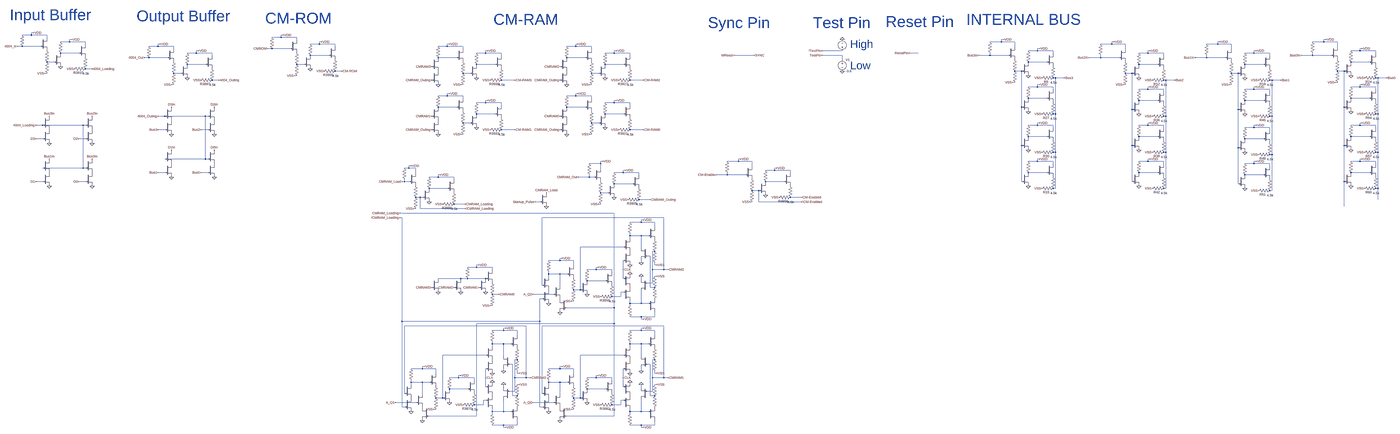
[diagram p0: schematic pins.asc, whole sheet]
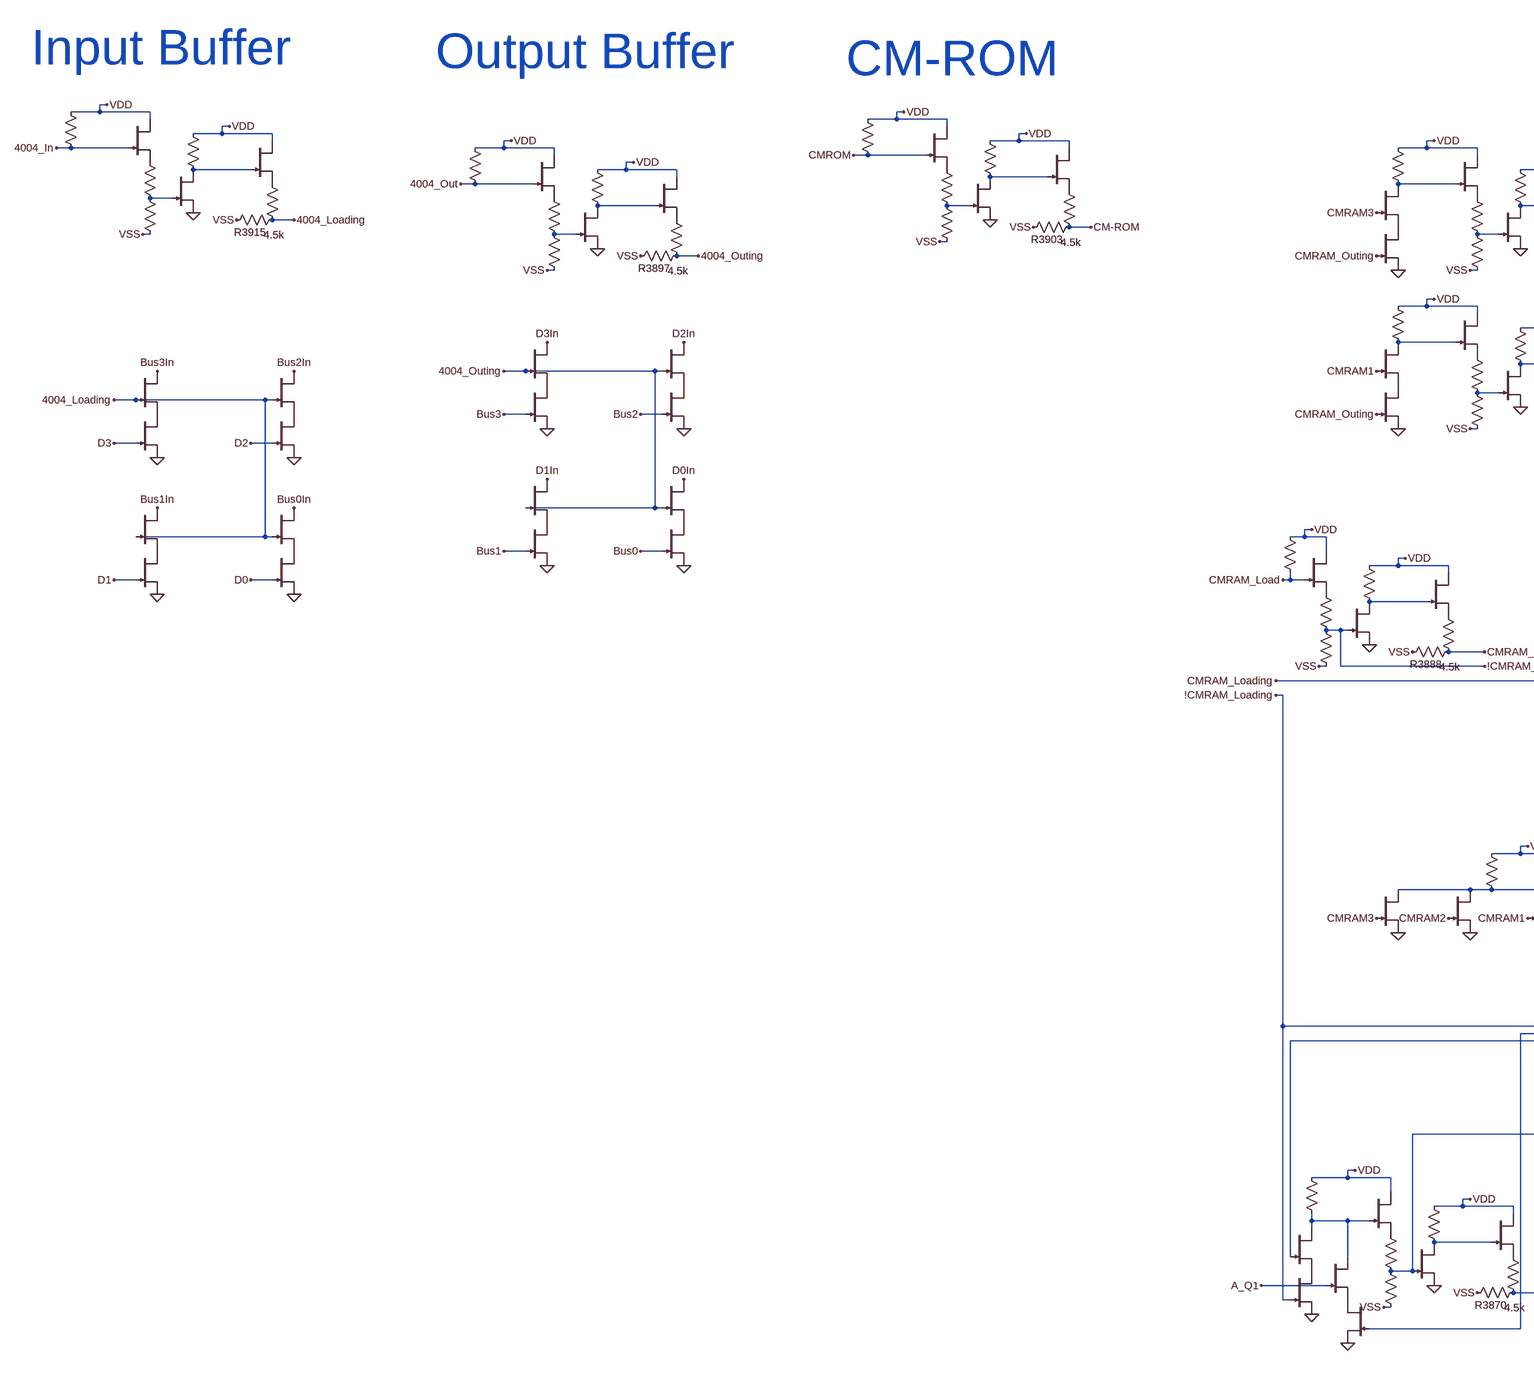
[diagram p1: schematic pins.asc, part, row 1 of 1, column 1 of 3]
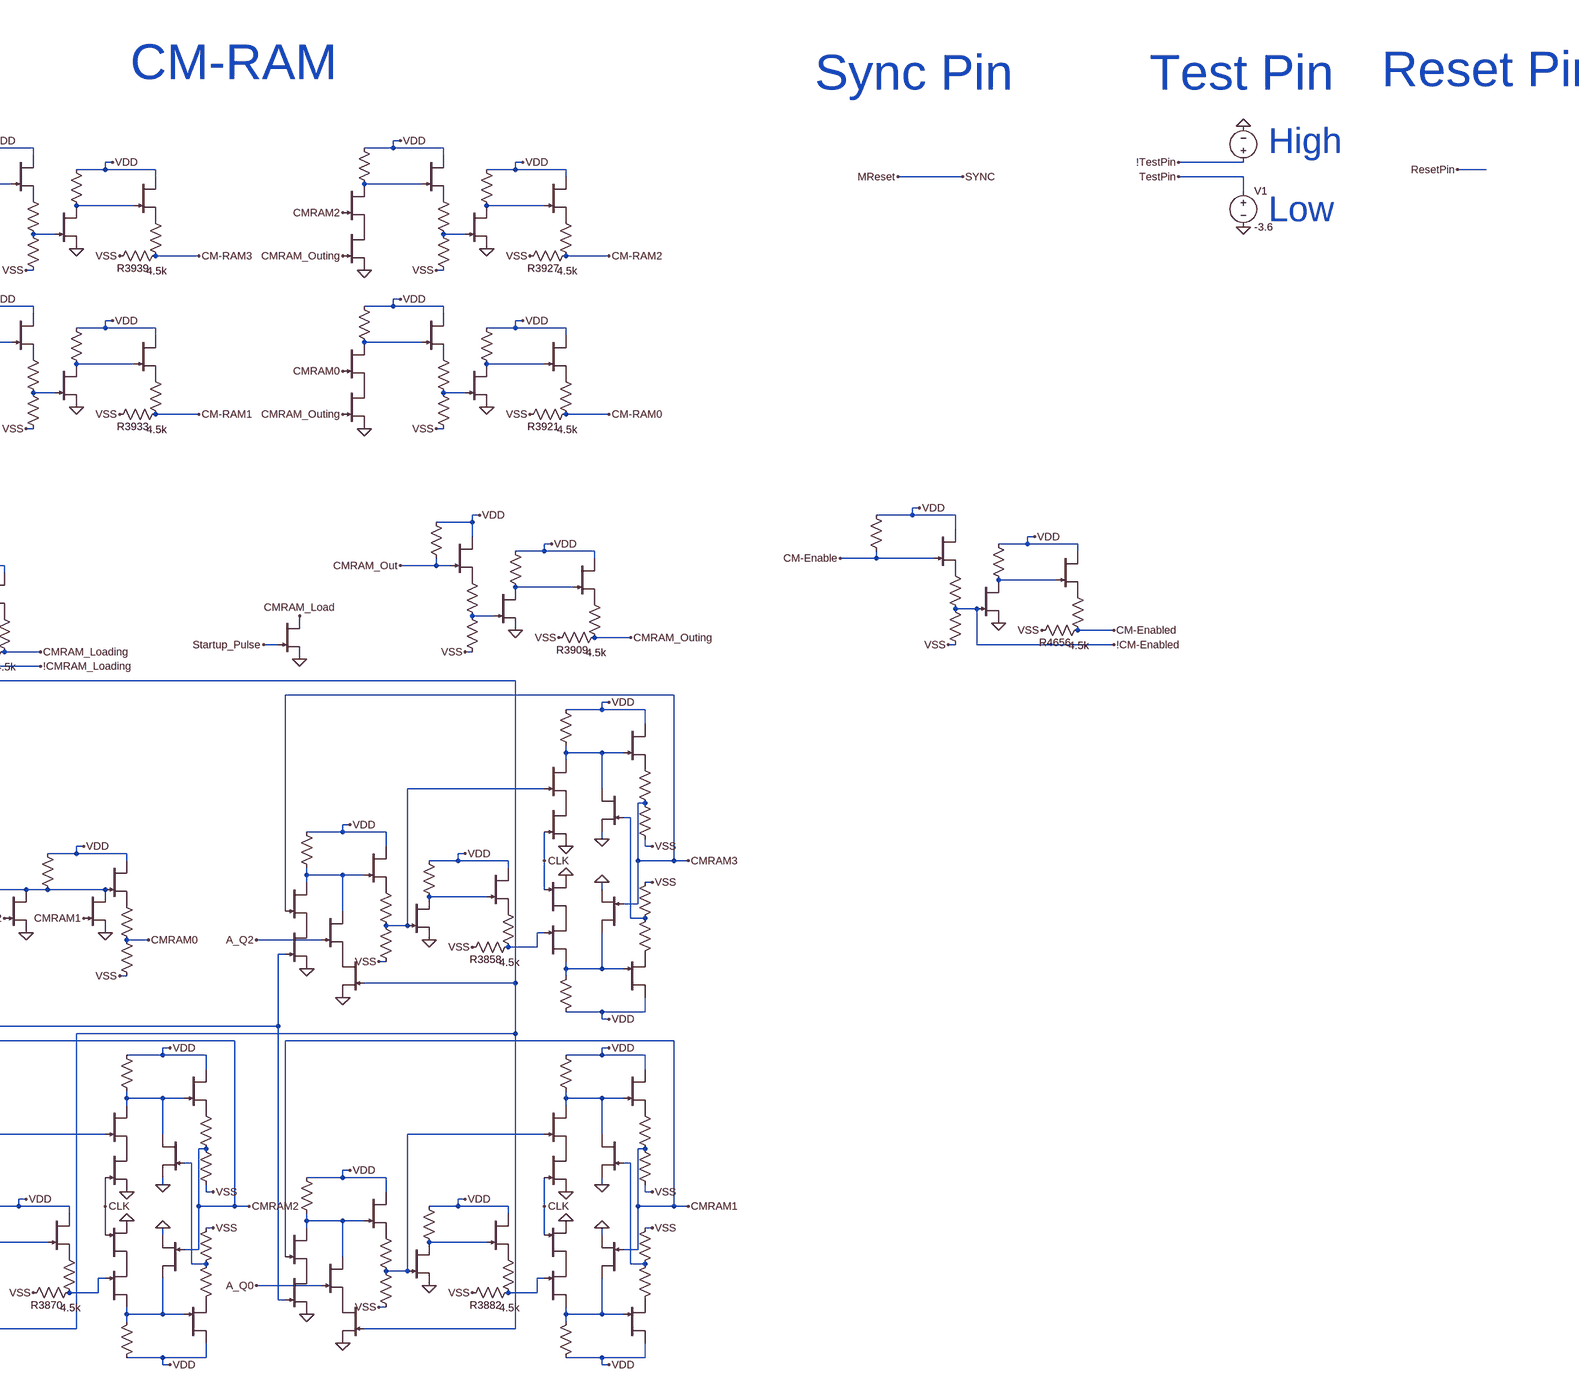
[diagram p2: schematic pins.asc, part, row 1 of 1, column 2 of 3]
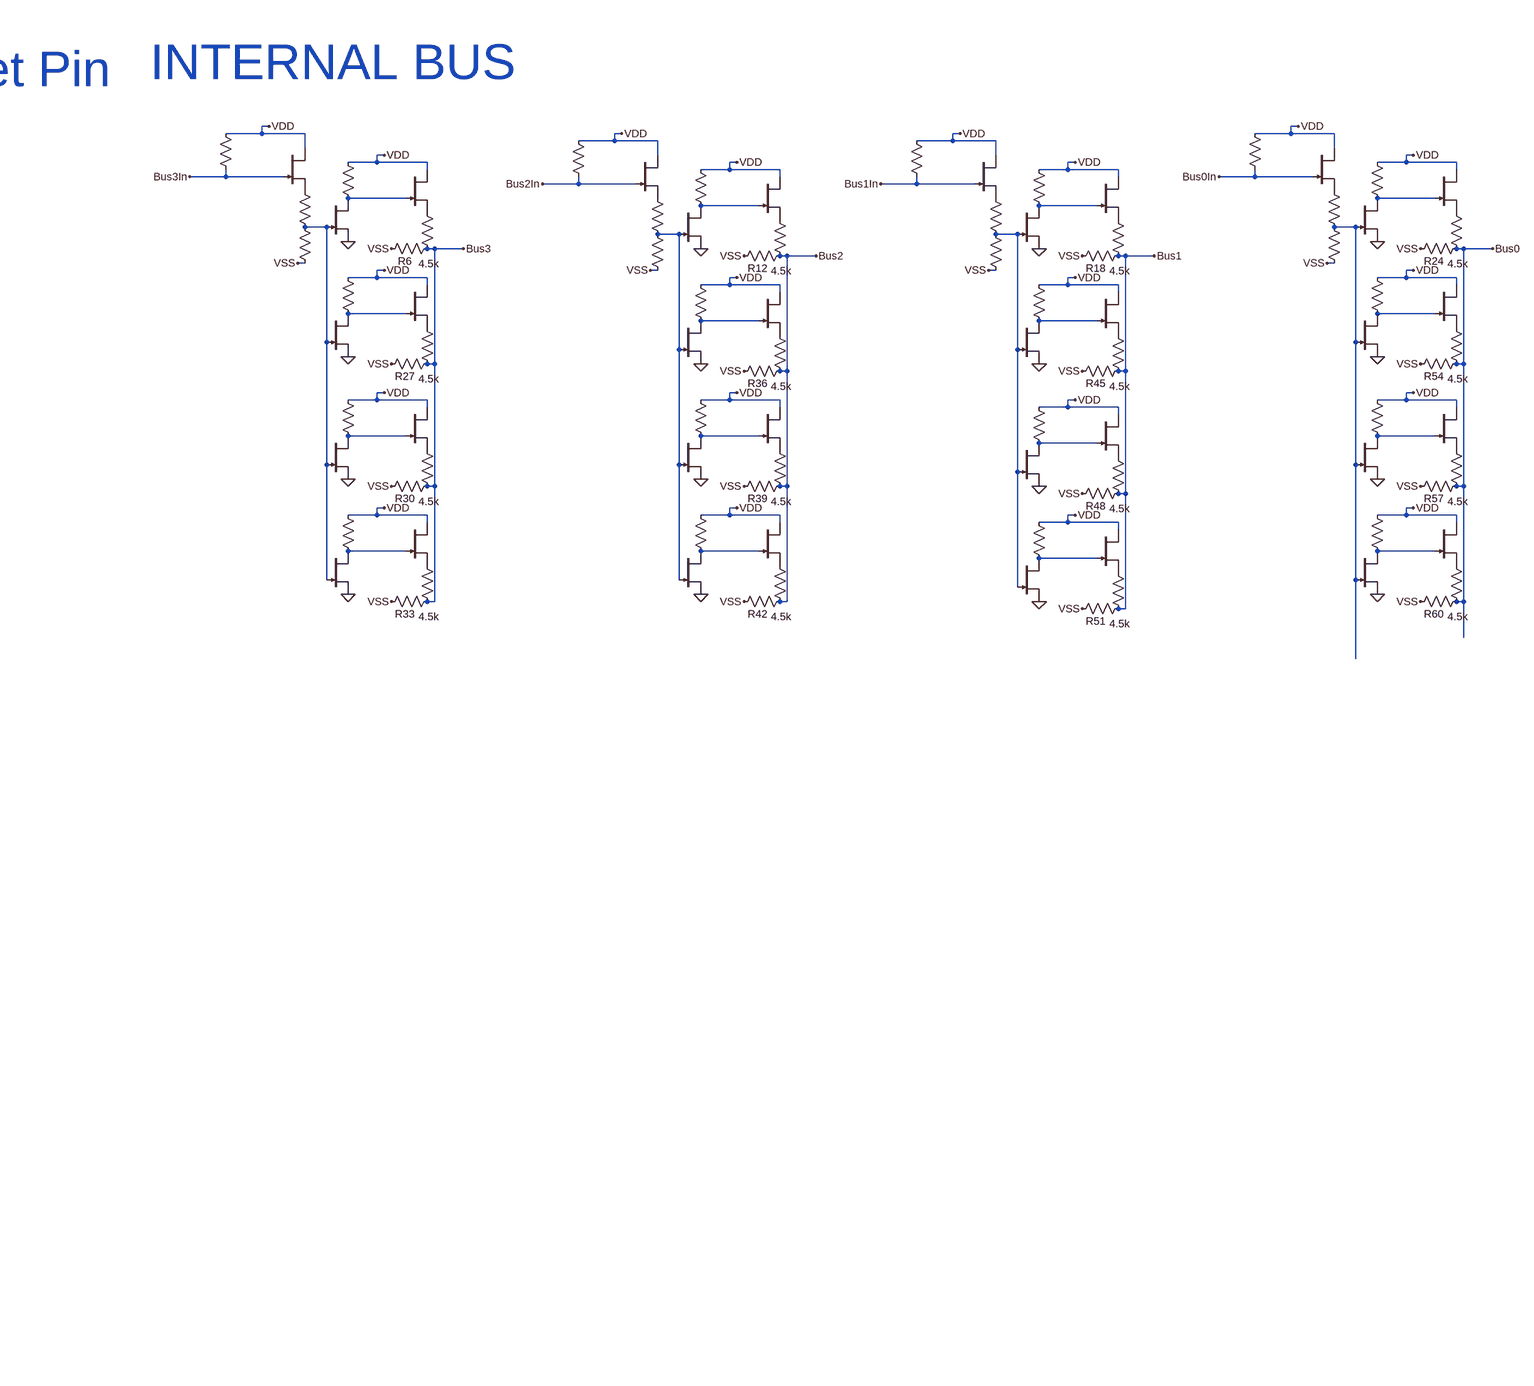
[diagram p3: schematic pins.asc, part, row 1 of 1, column 3 of 3]
* pins.asc
J_A2369 N043 N044 P001 DR
R3847 VDD N043 100k
J_F969 VDD N043 P002 DR
R3848 P002 CMRAM3 1k
R3849 CMRAM3 VSS 4.8k
J_B1117 N043 N045 0 DR
J_A2370 N050 N049 P003 DR
R3850 VDD N050 100k
J_F970 VDD N050 P004 DR
R3851 P004 N045 1k
R3852 N045 VSS 4.8k
J_B1118 N050 CMRAM3 0 DR
J_A2371 P001 CLK 0 DR
J_A2372 P003 CLK 0 DR
J_A2373 N046 CMRAM3 P005 DR
R3853 VDD N046 100k
J_F971 VDD N046 P006 DR
R3854 P006 N044 1k
R3855 N044 VSS 4.8k
J_B1119 N046 A_Q2 P007 DR
J_A2374 N048 N044 0 DR
R3856 VDD N048 50k
J_A2375 VDD N048 P008 DR
R3857 P008 N049 1k
R3858 N049 VSS 4.5k
J_A2376 P005 !CMRAM_Loading 0 DR
J_B1120 P007 CMRAM_Loading 0 DR
J_A2377 N051 N053 P009 DR
R3859 VDD N051 100k
J_F972 VDD N051 P010 DR
R3860 P010 CMRAM2 1k
R3861 CMRAM2 VSS 4.8k
J_B1121 N051 N055 0 DR
J_A2378 N063 N061 P011 DR
R3862 VDD N063 100k
J_F973 VDD N063 P012 DR
R3863 P012 N055 1k
R3864 N055 VSS 4.8k
J_B1122 N063 CMRAM2 0 DR
J_A2379 P009 CLK 0 DR
J_A2380 P011 CLK 0 DR
J_A2381 N057 CMRAM2 P013 DR
R3865 VDD N057 100k
J_F974 VDD N057 P014 DR
R3866 P014 N053 1k
R3867 N053 VSS 4.8k
J_B1123 N057 A_Q1 P015 DR
J_A2382 N059 N053 0 DR
R3868 VDD N059 50k
J_A2383 VDD N059 P016 DR
R3869 P016 N061 1k
R3870 N061 VSS 4.5k
J_A2384 P013 !CMRAM_Loading 0 DR
J_B1124 P015 CMRAM_Loading 0 DR
J_A2385 N052 N054 P017 DR
R3871 VDD N052 100k
J_F975 VDD N052 P018 DR
R3872 P018 CMRAM1 1k
R3873 CMRAM1 VSS 4.8k
J_B1125 N052 N056 0 DR
J_A2386 N064 N062 P019 DR
R3874 VDD N064 100k
J_F976 VDD N064 P020 DR
R3875 P020 N056 1k
R3876 N056 VSS 4.8k
J_B1126 N064 CMRAM1 0 DR
J_A2387 P017 CLK 0 DR
J_A2388 P019 CLK 0 DR
J_A2389 N058 CMRAM1 P021 DR
R3877 VDD N058 100k
J_F977 VDD N058 P022 DR
R3878 P022 N054 1k
R3879 N054 VSS 4.8k
J_B1127 N058 A_Q0 P023 DR
J_A2390 N060 N054 0 DR
R3880 VDD N060 50k
J_A2391 VDD N060 P024 DR
R3881 P024 N062 1k
R3882 N062 VSS 4.5k
J_A2392 P021 !CMRAM_Loading 0 DR
J_B1128 P023 CMRAM_Loading 0 DR
R3883 VDD CMRAM_Load 100k
J_F978 VDD CMRAM_Load P025 DR
R3884 P025 !CMRAM_Loading 1k
R3885 !CMRAM_Loading VSS 4.8k
J_A2393 N041 !CMRAM_Loading 0 DR
R3886 VDD N041 50k
J_A2394 VDD N041 P026 DR
R3887 P026 CMRAM_Loading 1k
R3888 CMRAM_Loading VSS 4.5k
J_A2395 N047 CMRAM3 0 DR
R3889 VDD N047 100k
J_F979 VDD N047 P027 DR
R3890 P027 CMRAM0 1k
R3891 CMRAM0 VSS 4.8k
J_B1129 N047 CMRAM2 0 DR
J_B1130 N047 CMRAM1 0 DR
J_Input12 CMRAM_Load Startup_Pulse 0 DR
R3892 VDD 4004_Out 100k
J_F980 VDD 4004_Out P028 DR
R3893 P028 N016 1k
R3894 N016 VSS 4.8k
J_A2396 N008 N016 0 DR
R3895 VDD N008 50k
J_F981 VDD N008 P029 DR
R3896 P029 4004_Outing 1k
R3897 4004_Outing VSS 4.5k
V1 TestPin 0 -3.6
V2 !TestPin 0 -800m
R3898 VDD CMROM 100k
J_F982 VDD CMROM P030 DR
R3899 P030 N009 1k
R3900 N009 VSS 4.8k
J_A2397 N002 N009 0 DR
R3901 VDD N002 50k
J_F983 VDD N002 P031 DR
R3902 P031 CM-ROM 1k
R3903 CM-ROM VSS 4.5k
R3904 VDD CMRAM_Out 100k
J_F984 VDD CMRAM_Out P032 DR
R3905 P032 N042 1k
R3906 N042 VSS 4.8k
J_A2398 N040 N042 0 DR
R3907 VDD N040 50k
J_A2399 VDD N040 P033 DR
R3908 P033 CMRAM_Outing 1k
R3909 CMRAM_Outing VSS 4.5k
R3910 VDD 4004_In 100k
J_F985 VDD 4004_In P034 DR
R3911 P034 N005 1k
R3912 N005 VSS 4.8k
J_A2400 N001 N005 0 DR
R3913 VDD N001 50k
J_F986 VDD N001 P035 DR
R3914 P035 4004_Loading 1k
R3915 4004_Loading VSS 4.5k
J_A2401 P036 D3 0 DR
J_A2402 Bus3In 4004_Loading P036 DR
J_A2403 P037 D2 0 DR
J_A2404 Bus2In 4004_Loading P037 DR
J_A2405 P038 D1 0 DR
J_A2406 Bus1In 4004_Loading P038 DR
J_A2407 P039 D0 0 DR
J_A2408 Bus0In 4004_Loading P039 DR
J_A2409 N026 CMRAM0 P040 DR
R3916 VDD N026 100k
J_F987 VDD N026 P041 DR
R3917 P041 N030 1k
R3918 N030 VSS 4.8k
J_B1131 P040 CMRAM_Outing 0 DR
J_A2410 N028 N030 0 DR
R3919 VDD N028 50k
J_F988 VDD N028 P042 DR
R3920 P042 CM-RAM0 1k
R3921 CM-RAM0 VSS 4.5k
J_A2411 N004 CMRAM2 P043 DR
R3922 VDD N004 100k
J_F989 VDD N004 P044 DR
R3923 P044 N018 1k
R3924 N018 VSS 4.8k
J_B1132 P043 CMRAM_Outing 0 DR
J_A2412 N011 N018 0 DR
R3925 VDD N011 50k
J_F990 VDD N011 P045 DR
R3926 P045 CM-RAM2 1k
R3927 CM-RAM2 VSS 4.5k
J_A2413 N025 CMRAM1 P046 DR
R3928 VDD N025 100k
J_F991 VDD N025 P047 DR
R3929 P047 N029 1k
R3930 N029 VSS 4.8k
J_B1133 P046 CMRAM_Outing 0 DR
J_A2414 N027 N029 0 DR
R3931 VDD N027 50k
J_F992 VDD N027 P048 DR
R3932 P048 CM-RAM1 1k
R3933 CM-RAM1 VSS 4.5k
J_A2415 N003 CMRAM3 P049 DR
R3934 VDD N003 100k
J_F993 VDD N003 P050 DR
R3935 P050 N017 1k
R3936 N017 VSS 4.8k
J_B1134 P049 CMRAM_Outing 0 DR
J_A2416 N010 N017 0 DR
R3937 VDD N010 50k
J_F994 VDD N010 P051 DR
R3938 P051 CM-RAM3 1k
R3939 CM-RAM3 VSS 4.5k
J_A2417 P052 Bus3 0 DR
J_A2418 D3In 4004_Outing P052 DR
J_A2419 P053 Bus2 0 DR
J_A2420 D2In 4004_Outing P053 DR
J_A2421 P054 Bus1 0 DR
J_A2422 D1In 4004_Outing P054 DR
J_A2423 P055 Bus0 0 DR
J_A2424 D0In 4004_Outing P055 DR
R4651 VDD CM-Enable 100k
J_F1230 VDD CM-Enable P056 DR
R4652 P056 !CM-Enabled 1k
R4653 !CM-Enabled VSS 4.8k
J_A2686 N039 !CM-Enabled 0 DR
R4654 VDD N039 50k
J_A2687 VDD N039 P057 DR
R4655 P057 CM-Enabled 1k
R4656 CM-Enabled VSS 4.5k
R1 VDD Bus3In 100k
J_F1 VDD Bus3In P058 DR
R2 P058 N014 1k
R3 N014 VSS 4.8k
J_A1 N006 N014 0 DR
R4 VDD N006 50k
J_A2 VDD N006 P059 DR
R5 P059 Bus3 1k
R6 Bus3 VSS 4.5k
R7 VDD Bus2In 100k
J_F2 VDD Bus2In P060 DR
R8 P060 N019 1k
R9 N019 VSS 4.8k
J_A3 N012 N019 0 DR
R10 VDD N012 50k
J_A4 VDD N012 P061 DR
R11 P061 Bus2 1k
R12 Bus2 VSS 4.5k
R13 VDD Bus1In 100k
J_F3 VDD Bus1In P062 DR
R14 P062 N020 1k
R15 N020 VSS 4.8k
J_A5 N013 N020 0 DR
R16 VDD N013 50k
J_A6 VDD N013 P063 DR
R17 P063 Bus1 1k
R18 Bus1 VSS 4.5k
R19 VDD Bus0In 100k
J_F4 VDD Bus0In P064 DR
R20 P064 N015 1k
R21 N015 VSS 4.8k
J_A7 N007 N015 0 DR
R22 VDD N007 50k
J_A8 VDD N007 P065 DR
R23 P065 Bus0 1k
R24 Bus0 VSS 4.5k
J_A9 N021 N014 0 DR
R25 VDD N021 50k
J_A10 VDD N021 P066 DR
R26 P066 Bus3 1k
R27 Bus3 VSS 4.5k
J_A11 N031 N014 0 DR
R28 VDD N031 50k
J_A12 VDD N031 P067 DR
R29 P067 Bus3 1k
R30 Bus3 VSS 4.5k
J_A13 N035 N014 0 DR
R31 VDD N035 50k
J_A14 VDD N035 P068 DR
R32 P068 Bus3 1k
R33 Bus3 VSS 4.5k
J_A15 N023 N019 0 DR
R34 VDD N023 50k
J_A16 VDD N023 P069 DR
R35 P069 Bus2 1k
R36 Bus2 VSS 4.5k
J_A17 N032 N019 0 DR
R37 VDD N032 50k
J_A18 VDD N032 P070 DR
R38 P070 Bus2 1k
R39 Bus2 VSS 4.5k
J_A19 N036 N019 0 DR
R40 VDD N036 50k
J_A20 VDD N036 P071 DR
R41 P071 Bus2 1k
R42 Bus2 VSS 4.5k
J_A21 N024 N020 0 DR
R43 VDD N024 50k
J_A22 VDD N024 P072 DR
R44 P072 Bus1 1k
R45 Bus1 VSS 4.5k
J_A23 N034 N020 0 DR
R46 VDD N034 50k
J_A24 VDD N034 P073 DR
R47 P073 Bus1 1k
R48 Bus1 VSS 4.5k
J_A25 N038 N020 0 DR
R49 VDD N038 50k
J_A26 VDD N038 P074 DR
R50 P074 Bus1 1k
R51 Bus1 VSS 4.5k
J_A27 N022 N015 0 DR
R52 VDD N022 50k
J_A28 VDD N022 P075 DR
R53 P075 Bus0 1k
R54 Bus0 VSS 4.5k
J_A29 N033 N015 0 DR
R55 VDD N033 50k
J_A30 VDD N033 P076 DR
R56 P076 Bus0 1k
R57 Bus0 VSS 4.5k
J_A31 N037 N015 0 DR
R58 VDD N037 50k
J_A32 VDD N037 P077 DR
R59 P077 Bus0 1k
R60 Bus0 VSS 4.5k
.model NJF NJF
.model PJF PJF
.lib standard.jft
* Output Buffer
* CM-ROM
* Sync Pin
* Test Pin
* High
* Low
* Reset Pin
* CM-RAM
* Input Buffer
* INTERNAL BUS
.backanno
.end